# Altium schematic sheet SCH_A3_Temp.SchDoc
size A3
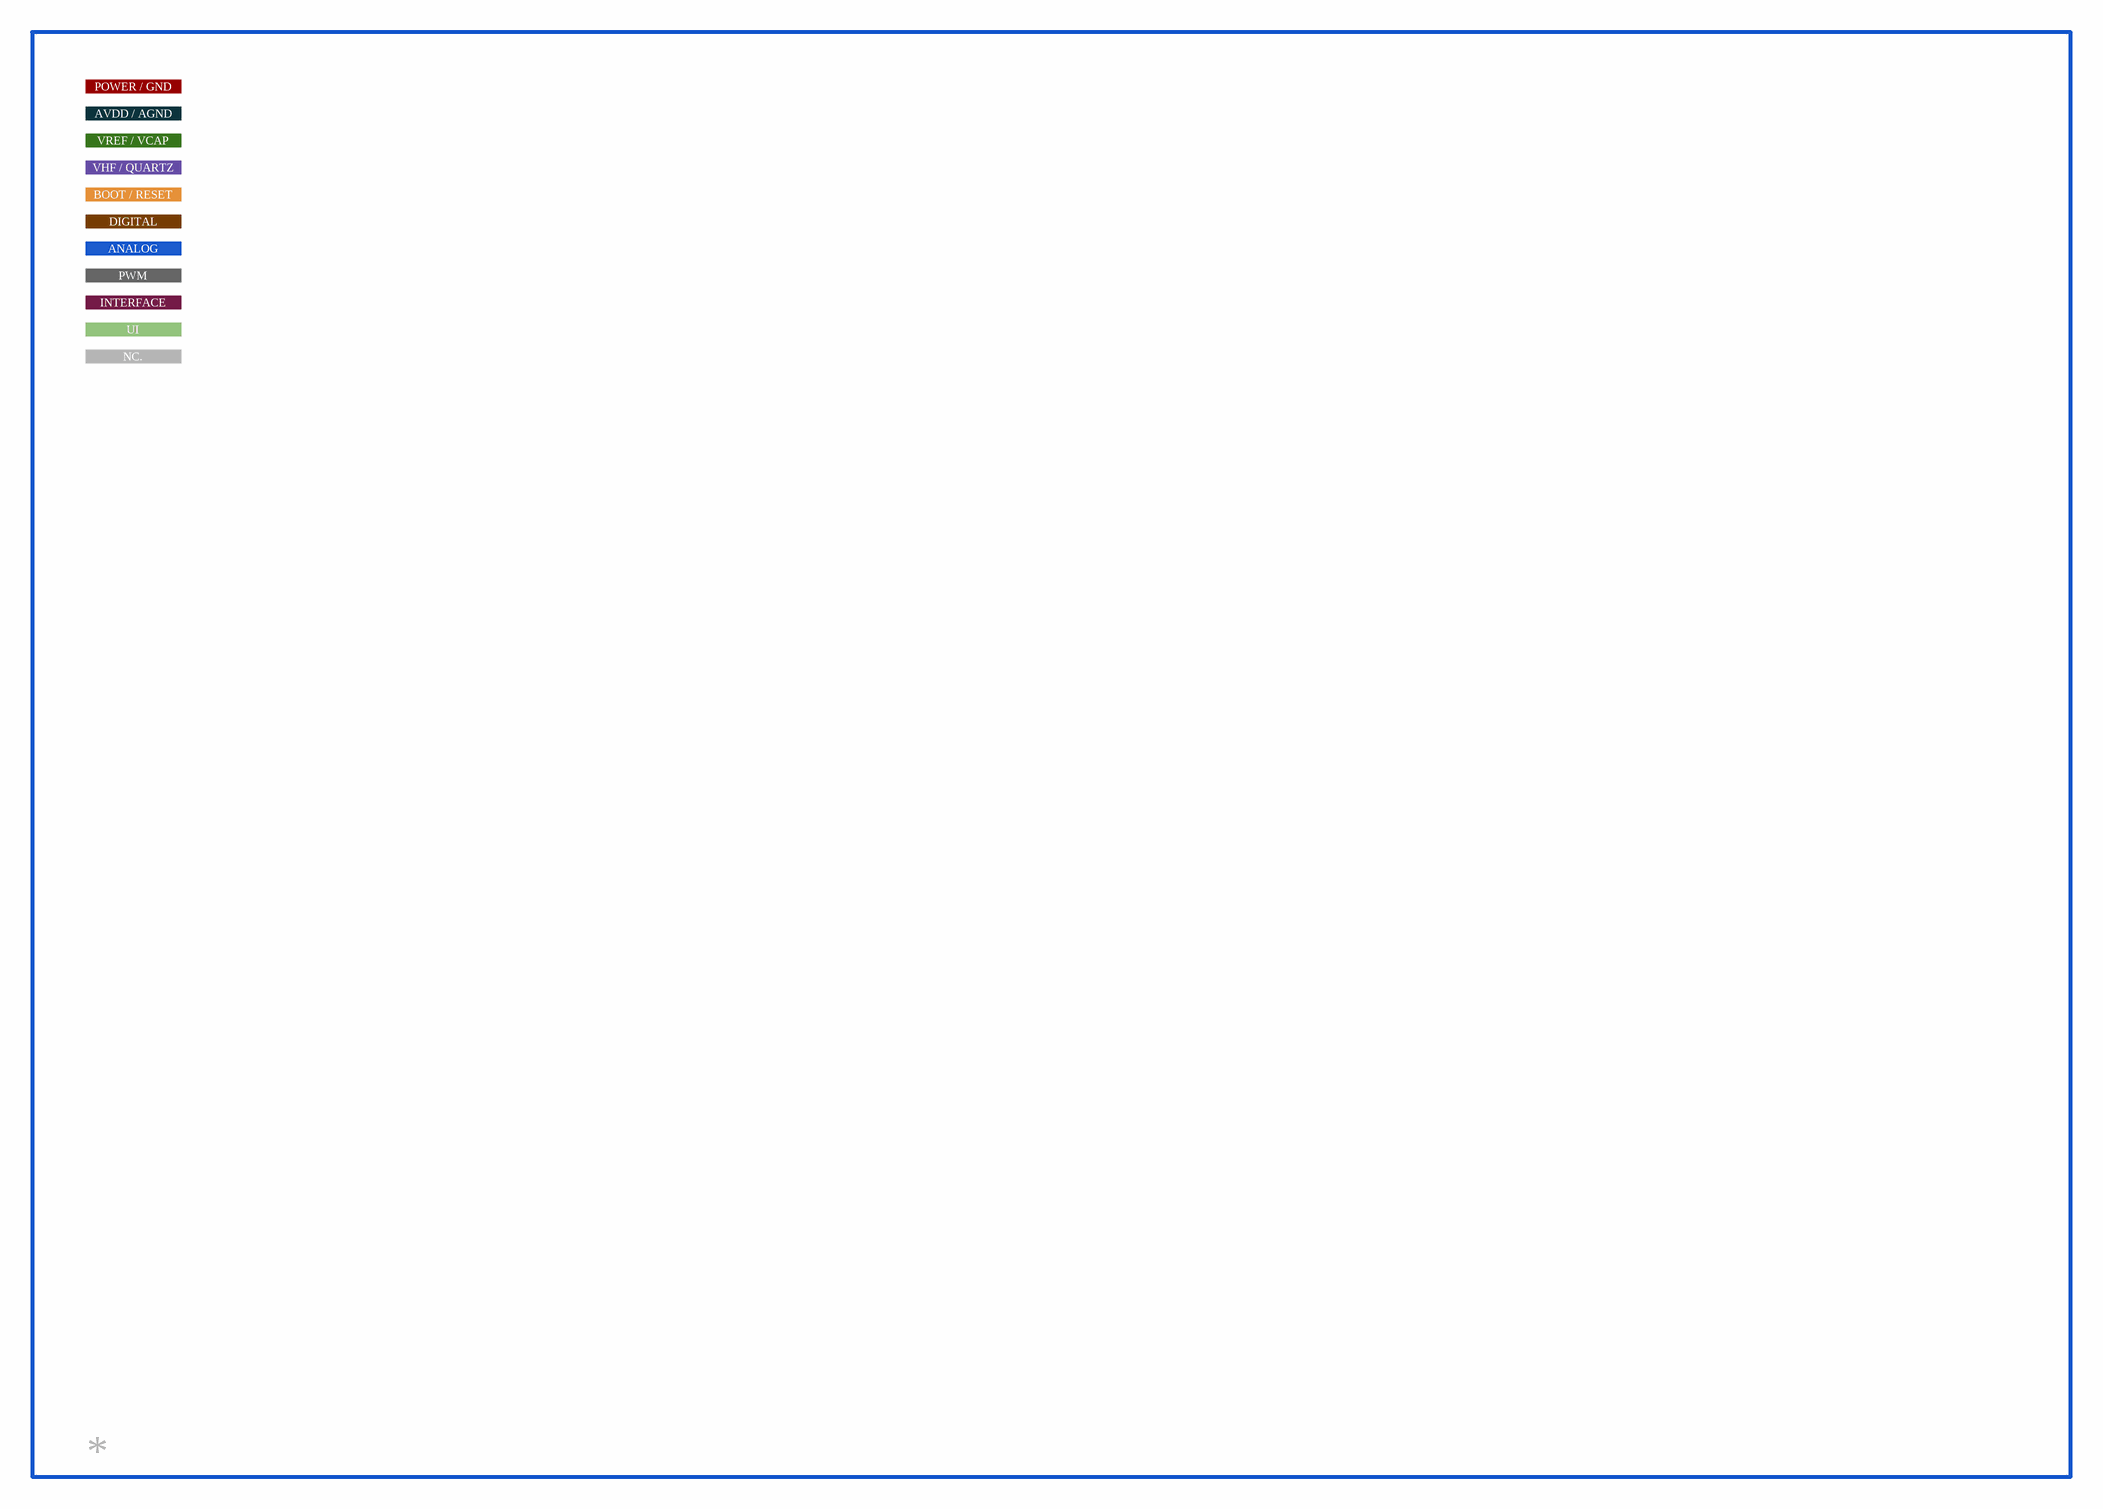
[diagram p0: SCH_A3_Temp.SchDoc]

## Ports
ANALOG, AVDD / AGND, BOOT / RESET, DIGITAL, INTERFACE, NC., POWER / GND, PWM, UI, VHF / QUARTZ, VREF / VCAP